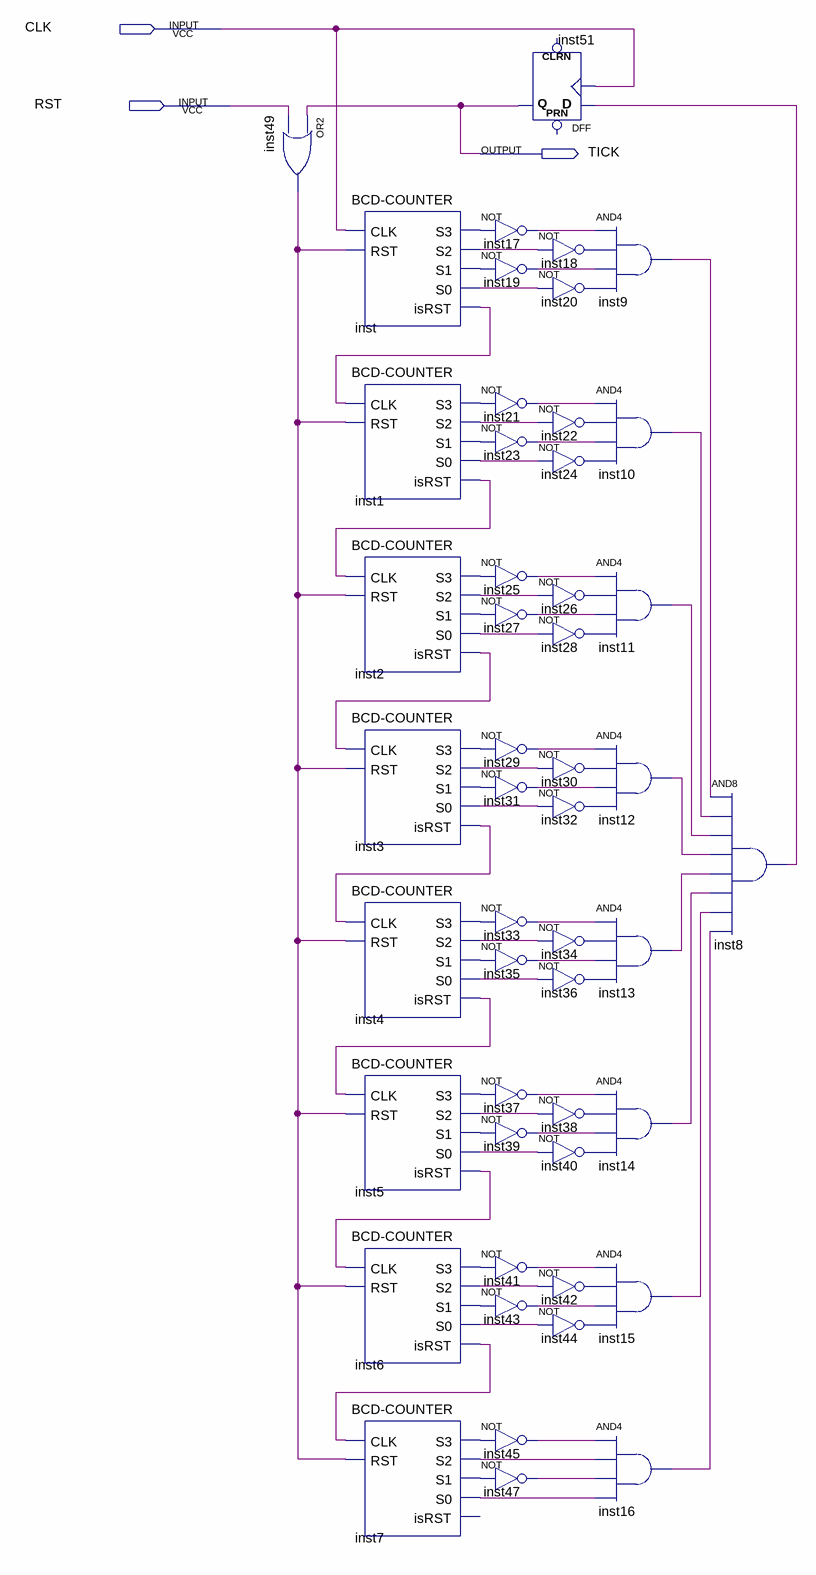
[diagram p0: schematic sheet]
// Quartus schematic PreciseTimer.bdf as structural Verilog: 49 symbols, 3 pins
module PreciseTimer (
  input  CLK,
  input  RST,
  output TICK
);

  wire inst1_isrst, inst1_s0, inst1_s1, inst1_s2, inst1_s3, inst2_isrst, inst2_s0, inst2_s1, inst2_s2,
       inst2_s3, inst3_isrst, inst3_s0, inst3_s1, inst3_s2, inst3_s3, inst4_isrst, inst4_s0, inst4_s1,
       inst4_s2, inst4_s3, inst5_isrst, inst5_s0, inst5_s1, inst5_s2, inst5_s3, inst6_isrst, inst6_s0,
       inst6_s1, inst6_s2, inst6_s3, inst7_s0, inst7_s1, inst7_s2, inst7_s3, inst8_out, inst9_out,
       inst10_out, inst11_out, inst12_out, inst13_out, inst14_out, inst15_out, inst16_out, inst17_out,
       inst18_out, inst19_out, inst20_out, inst21_out, inst22_out, inst23_out, inst24_out, inst25_out,
       inst26_out, inst27_out, inst28_out, inst29_out, inst30_out, inst31_out, inst32_out, inst33_out,
       inst34_out, inst35_out, inst36_out, inst37_out, inst38_out, inst39_out, inst40_out, inst41_out,
       inst42_out, inst43_out, inst44_out, inst45_out, inst47_out, inst49_out, inst_isrst, inst_s0, inst_s1,
       inst_s2, inst_s3;

  or inst49 (inst49_out, TICK, RST);
  \BCD-COUNTER  inst (
    .CLK(CLK), .RST(inst49_out), .S3(inst_s3), .S2(inst_s2), .S1(inst_s1), .S0(inst_s0), .isRST(inst_isrst));
  \BCD-COUNTER  inst1 (
    .CLK(inst_isrst), .RST(inst49_out), .S3(inst1_s3), .S2(inst1_s2), .S1(inst1_s1), .S0(inst1_s0),
    .isRST(inst1_isrst));
  \BCD-COUNTER  inst2 (
    .CLK(inst1_isrst), .RST(inst49_out), .S3(inst2_s3), .S2(inst2_s2), .S1(inst2_s1), .S0(inst2_s0),
    .isRST(inst2_isrst));
  \BCD-COUNTER  inst3 (
    .CLK(inst2_isrst), .RST(inst49_out), .S3(inst3_s3), .S2(inst3_s2), .S1(inst3_s1), .S0(inst3_s0),
    .isRST(inst3_isrst));
  \BCD-COUNTER  inst4 (
    .CLK(inst3_isrst), .RST(inst49_out), .S3(inst4_s3), .S2(inst4_s2), .S1(inst4_s1), .S0(inst4_s0),
    .isRST(inst4_isrst));
  \BCD-COUNTER  inst5 (
    .CLK(inst4_isrst), .RST(inst49_out), .S3(inst5_s3), .S2(inst5_s2), .S1(inst5_s1), .S0(inst5_s0),
    .isRST(inst5_isrst));
  \BCD-COUNTER  inst6 (
    .CLK(inst5_isrst), .RST(inst49_out), .S3(inst6_s3), .S2(inst6_s2), .S1(inst6_s1), .S0(inst6_s0),
    .isRST(inst6_isrst));
  \BCD-COUNTER  inst7 (
    .CLK(inst6_isrst), .RST(inst49_out), .S3(inst7_s3), .S2(inst7_s2), .S1(inst7_s1), .S0(inst7_s0));  // open: isRST
  DFF inst51 (.CLK(CLK), .D(inst8_out), .Q(TICK));  // open: CLRN, PRN
  not inst17 (inst17_out, inst_s3);
  not inst19 (inst19_out, inst_s1);
  not inst21 (inst21_out, inst1_s3);
  not inst23 (inst23_out, inst1_s1);
  not inst25 (inst25_out, inst2_s3);
  not inst27 (inst27_out, inst2_s1);
  not inst29 (inst29_out, inst3_s3);
  not inst31 (inst31_out, inst3_s1);
  not inst33 (inst33_out, inst4_s3);
  not inst35 (inst35_out, inst4_s1);
  not inst37 (inst37_out, inst5_s3);
  not inst39 (inst39_out, inst5_s1);
  not inst41 (inst41_out, inst6_s3);
  not inst43 (inst43_out, inst6_s1);
  not inst45 (inst45_out, inst7_s3);
  not inst47 (inst47_out, inst7_s1);
  and inst9 (inst9_out, inst17_out, inst18_out, inst19_out, inst20_out);
  not inst18 (inst18_out, inst_s2);
  not inst20 (inst20_out, inst_s0);
  and inst10 (inst10_out, inst21_out, inst22_out, inst23_out, inst24_out);
  not inst22 (inst22_out, inst1_s2);
  not inst24 (inst24_out, inst1_s0);
  and inst11 (inst11_out, inst25_out, inst26_out, inst27_out, inst28_out);
  not inst26 (inst26_out, inst2_s2);
  not inst28 (inst28_out, inst2_s0);
  and inst12 (inst12_out, inst29_out, inst30_out, inst31_out, inst32_out);
  not inst30 (inst30_out, inst3_s2);
  not inst32 (inst32_out, inst3_s0);
  and inst13 (inst13_out, inst33_out, inst34_out, inst35_out, inst36_out);
  not inst34 (inst34_out, inst4_s2);
  not inst36 (inst36_out, inst4_s0);
  and inst14 (inst14_out, inst37_out, inst38_out, inst39_out, inst40_out);
  not inst38 (inst38_out, inst5_s2);
  not inst40 (inst40_out, inst5_s0);
  and inst15 (inst15_out, inst41_out, inst42_out, inst43_out, inst44_out);
  not inst42 (inst42_out, inst6_s2);
  not inst44 (inst44_out, inst6_s0);
  and inst16 (inst16_out, inst45_out, inst7_s2, inst47_out, inst7_s0);
  and inst8 (inst8_out, inst9_out, inst10_out, inst11_out, inst12_out, inst13_out, inst14_out, inst15_out, inst16_out);
endmodule
